# EAGLE design lab5_sriley (EAGLE 9.6.2)
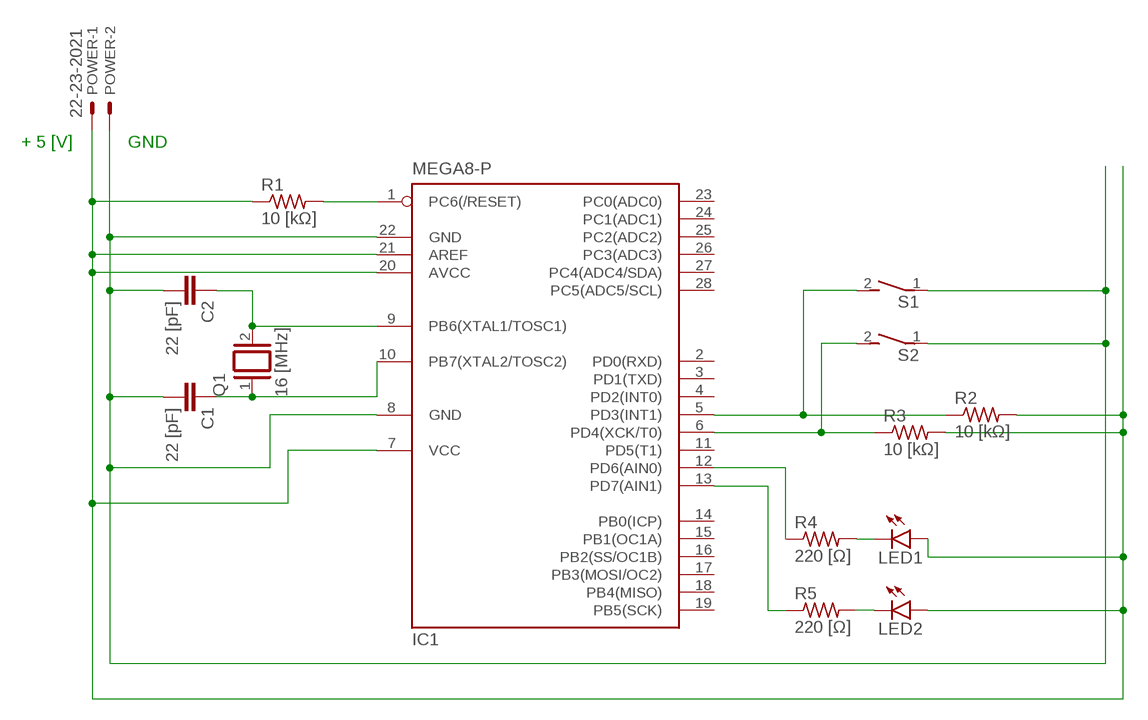
[diagram p0: schematic, sheet 1]

## Parts
C1  22 [pF]  C2,5-3  [C2.5-3]
C2  22 [pF]  C2,5-3  [C2.5-3]
IC1  MEGA8-P  [DIL28-3]
LED1  LED5MM  [LED5MM]
LED2  LED5MM  [LED5MM]
POWER  22-23-2021  [22-23-2021]
Q1  16 [MHz]  XTAL  [Q]
R1  10 [kΩ]  R-US_0204/7  [0204/7]
R2  10 [kΩ]  R-US_0204/7  [0204/7]
R3  10 [kΩ]  R-US_0204/7  [0204/7]
R4  220 [Ω]  R-US_0204/7  [0204/7]
R5  220 [Ω]  R-US_0204/7  [0204/7]
S1  DS01E  [DS-01]
S2  DS01E  [DS-01]

## Nets
N$1: C2.1 IC1.9(PB6(XTAL1/TOSC1)) Q1.2
N$2: C1.1 IC1.10(PB7(XTAL2/TOSC2)) Q1.1
N$3: C1.2 C2.2 IC1.8(GND) IC1.22(GND) POWER.2 S1.1 S2.1
N$4: IC1.7(VCC) IC1.20(AVCC) IC1.21(AREF) LED1.A LED2.A POWER.1 R1.1 R2.2 R3.2
N$5: IC1.1(PC6(/RESET)) R1.2
N$6: IC1.5(PD3(INT1)) R2.1 S1.2
N$7: IC1.6(PD4(XCK/T0)) R3.1 S2.2
N$8: LED1.K(C) R4.2
N$9: LED2.K(C) R5.2
N$10: IC1.12(PD6(AIN0)) R4.1
N$11: IC1.13(PD7(AIN1)) R5.1
Unconnected: IC1.2(PD0(RXD)) IC1.3(PD1(TXD)) IC1.4(PD2(INT0)) IC1.11(PD5(T1)) IC1.14(PB0(ICP)) IC1.15(PB1(OC1A)) IC1.16(PB2(SS/OC1B)) IC1.17(PB3(MOSI/OC2)) IC1.18(PB4(MISO)) IC1.19(PB5(SCK)) IC1.23(PC0(ADC0)) IC1.24(PC1(ADC1)) IC1.25(PC2(ADC2)) IC1.26(PC3(ADC3)) IC1.27(PC4(ADC4/SDA)) IC1.28(PC5(ADC5/SCL))

## Notes on the sheet
- + 5 [V] | GND

## Library data of the parts
C1 C2 = capacitor-wima:C: CAPACITOR naming: grid - package width
IC1 = atmel:MEGA8-P: MICROCONTROLLER 8 Kbytes FLASH, 1 kbytes SRAM, 512 bytes EEPROM, USART, 4-channel 10 bit ADC, 2-channel 8 bit ADC Pin compatible with Atmega48, ATMega88, ATMega168 Source: avr.lbr; OC_FARNELL: unknown; OC_NEWARK: unknown
LED1 LED2 = led:LED: LED OSRAM: - CHIPLED LG R971, LG N971, LY N971, LG Q971, LY Q971, LO R971, LY R971 LH N974, LH R974 LS Q976, LO Q976, LY Q976 LO Q996 - Hyper CHIPLED LW Q18S LB Q993, LB Q99A, LB R99A - SideLED LS A670, LO A670, LY A670, LG A670, LP A670 LB A673, LV A673, LT A673, LW A673 LH A674 LY A675 LS A676, LA A676, LO A676, LY A676, LW A676 LS A679, LY A679, LG A679 - Hyper Micro SIDELED® LS Y876, LA Y876, LO Y876, LY Y876 LT Y87S - SmartLED LW L88C, LW L88S LB L89C, LB L89S, LG L890 LS L89K, LO L89K, LY L89K LS L896, LA L896, LO L896, LY L896 - TOPLED LS T670, LO T670, LY T670, LG T670, LP T670 LSG T670, LSP T670, LSY T670, LOP T670, LYG T670 LG T671, LOG T671, LSG T671 LB T673, LV T673, LT T673, LW T673 LH T674 LS T676, LA T676, LO T676, LY T676, LB T676, LH T676, LSB T676, LW T676 LB T67C, LV T67C, LT T67C, LS T67K, LO T67K, LY T67K, LW E67C LS E67B, LA E67B, LO E67B, LY E67B, LB E67C, LV E67C, LT E67C LW T67C LS T679, LY T679, LG T679 LS T770, LO T770, LY T770, LG T770, LP T770 LB T773, LV T773, LT T773, LW T773 LH T774 LS E675, LA E675, LY E675, LS T675 LS T776, LA T776, LO T776, LY T776, LB T776 LHGB T686 LT T68C, LB T68C - Hyper Mini TOPLED® LB M676 - Mini TOPLED Santana® LG M470 LS M47K, LO M47K, LY M47K Source: http://www.osram.convergy.de LUXEON: - LUMILED® LXK2-PW12-R00, LXK2-PW12-S00, LXK2-PW14-U00, LXK2-PW14-V00 LXK2-PM12-R00, LXK2-PM12-S00, LXK2-PM14-U00 LXK2-PE12-Q00, LXK2-PE12-R00, LXK2-PE12-S00, LXK2-PE14-T00, LXK2-PE14-U00 LXK2-PB12-K00, LXK2-PB12-L00, LXK2-PB12-M00, LXK2-PB14-N00, LXK2-PB14-P00, LXK2-PB14-Q00 LXK2-PR12-L00, LXK2-PR12-M00, LXK2-PR14-Q00, LXK2-PR14-R00 LXK2-PD12-Q00, LXK2-PD12-R00, LXK2-PD12-S00 LXK2-PH12-R00, LXK2-PH12-S00 LXK2-PL12-P00, LXK2-PL12-Q00, LXK2-PL12-R00 Source: www.luxeon.com KINGBRIGHT: KA-3528ASYC Source: www.kingbright.com
POWER = con-molex:22-23-2021: .100" (2.54mm) Center Header - 2 Pin; MF: MOLEX; MPN: 22-23-2021; OC_FARNELL: 1462926; OC_NEWARK: 25C3832
Q1 = special:XTAL: CRYSTAL
R1-R5 = rcl:R-US_: RESISTOR, American symbol; SPICEPREFIX: R
S1 S2 = switch-dil:DS01E: DIL/CODE SWITCH; OC_FARNELL: unknown; OC_NEWARK: unknown

## Net classes
0 default: width 0.813 mm

## Board
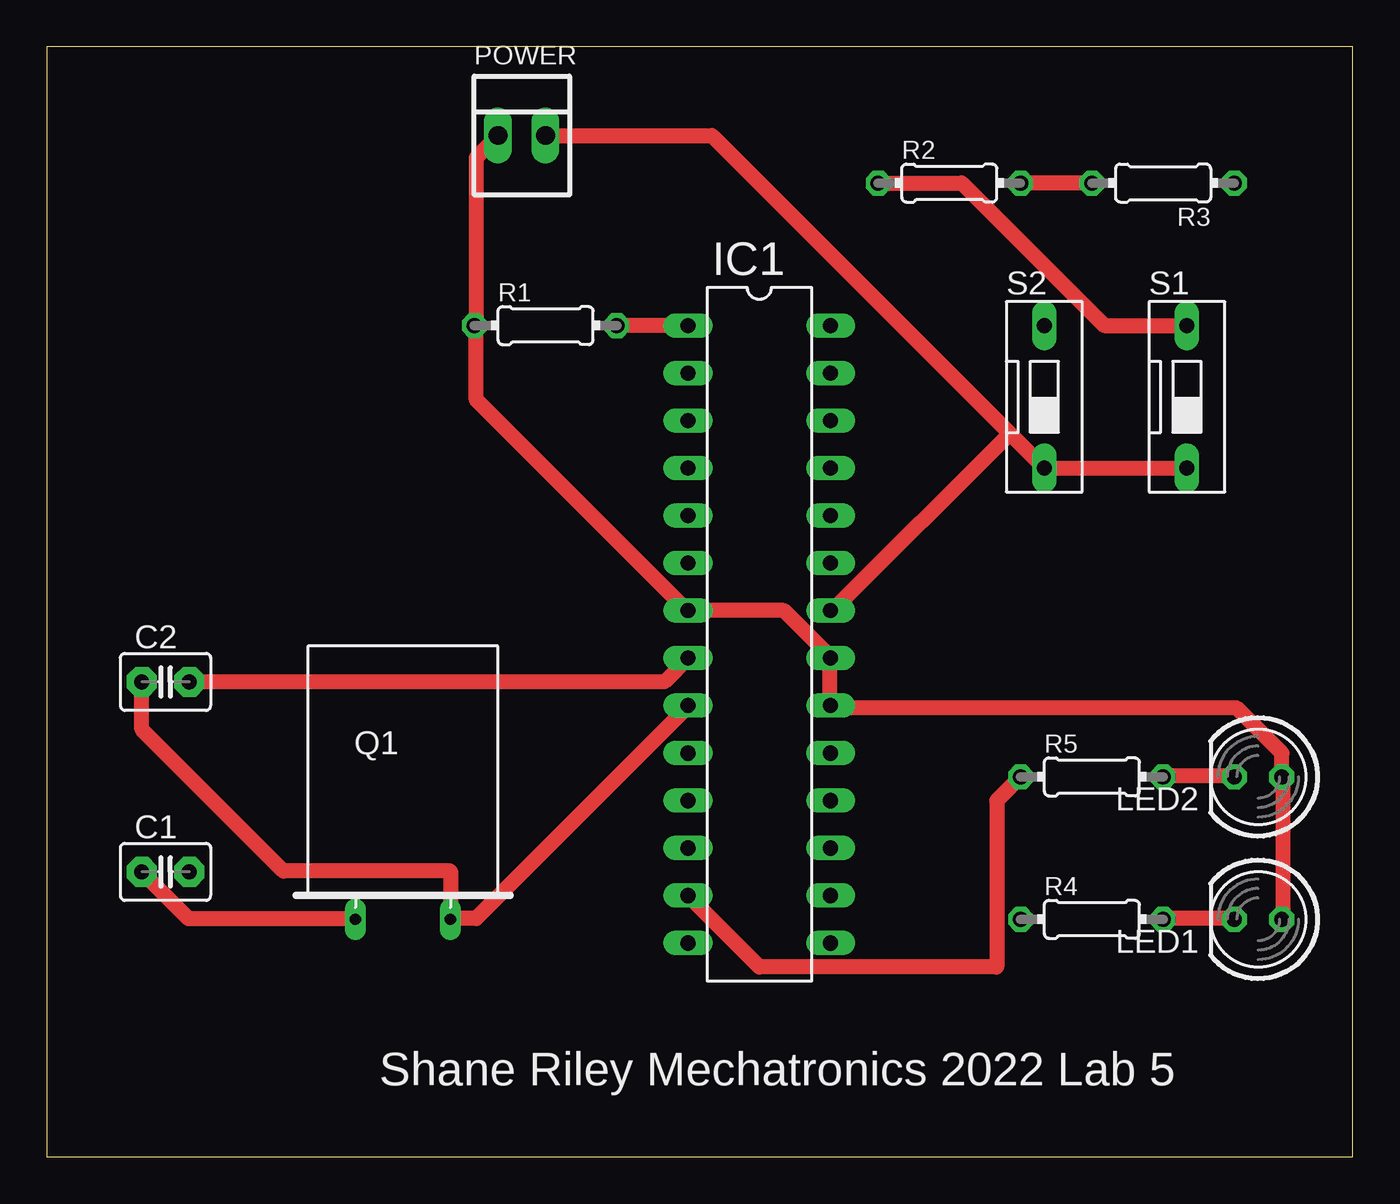
[diagram p1: board, top side]
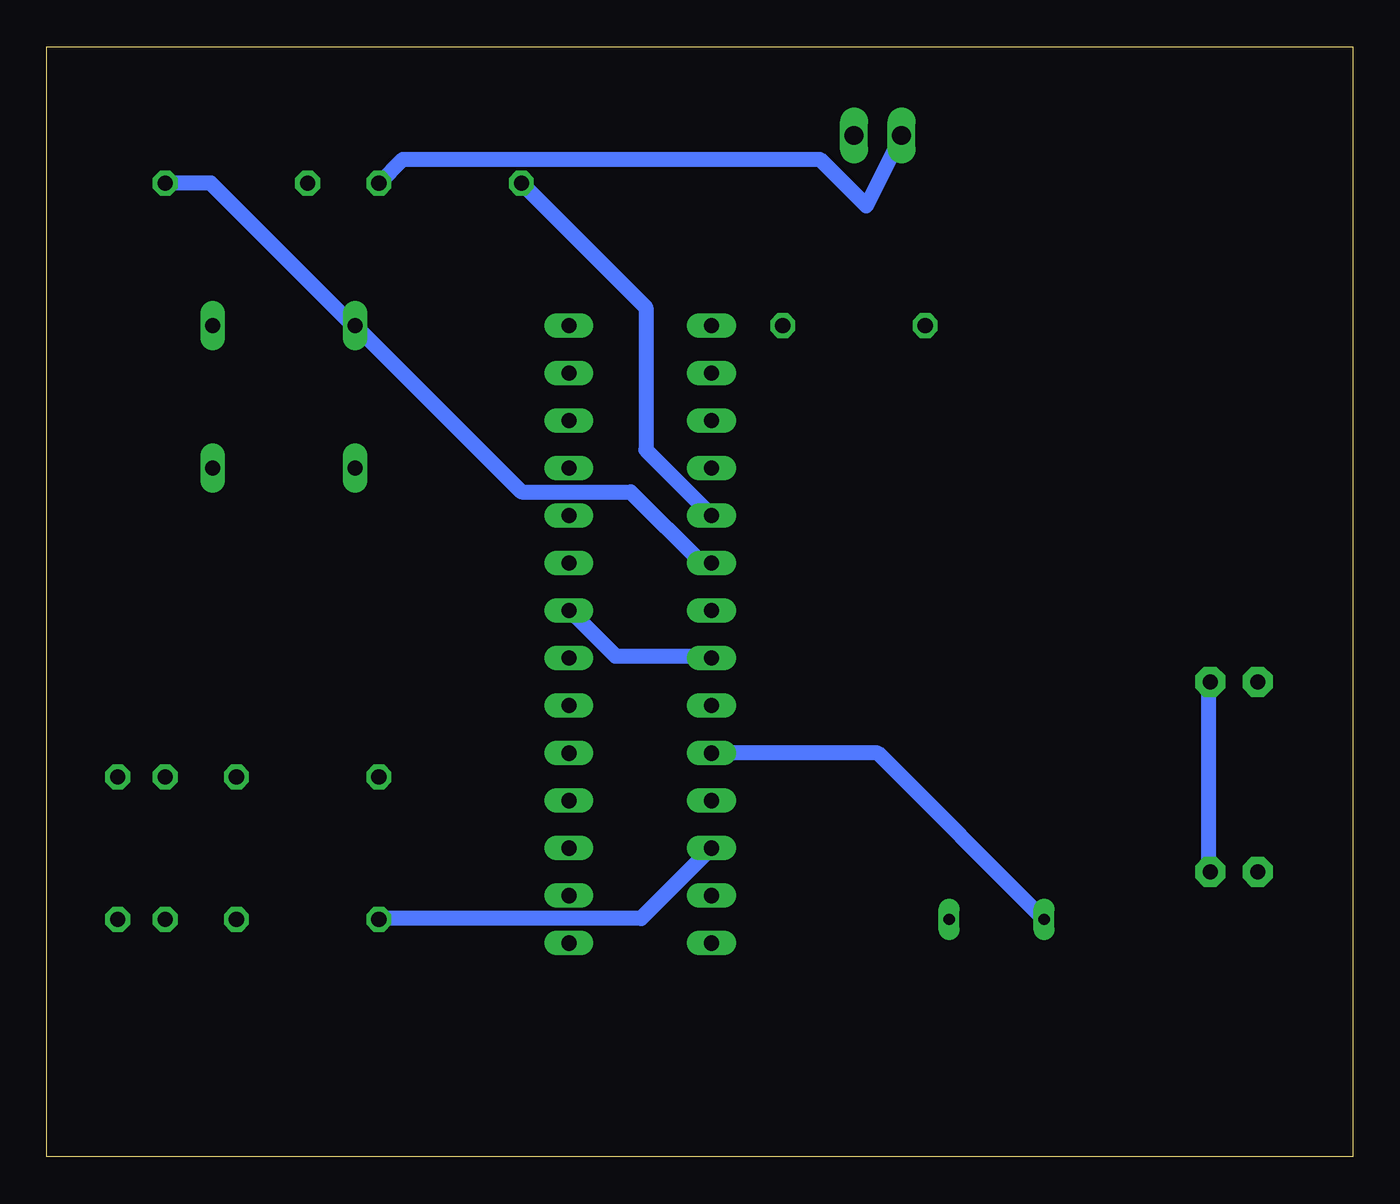
[diagram p2: board, bottom side, seen from below]

Size 69.83 x 59.36 mm. Coordinates in mm from the lower left corner, seen from the top.
Outline: 0,0 69.83,0 69.83,59.36 0,59.36 0,0
Copper layers (1*16): Top 0.035mm / dielectric 1.5mm / Bottom 0.035mm
Design rules "default *": minimum track width 6mil, minimum drill 0.35mm, track to track 6mil, track to pad 6mil, pad to pad 6mil, via to via 6mil, smd to smd 6mil, copper to edge 40mil, drill to drill 6mil, minimum pad ring 10mil, minimum via ring 8mil, stop-mask expansion 4mil, vias tented up to drill 0mil, thermal gap 10mil

### Footprints (pad centres in the part's own frame; a part is rotated, then mirrored left to right if it is on the bottom)
C2.5-3 = drill 0.813 pad 1.6 octagon: 1 -1.27,0; 2 1.27,0
DIL28-3 = drill 0.813 long: 1 -16.51,-3.81; 2 -13.97,-3.81; 3 -11.43,-3.81; 4 -8.89,-3.81; 5 -6.35,-3.81; 6 -3.81,-3.81; 7 -1.27,-3.81; 8 1.27,-3.81; 9 3.81,-3.81; 10 6.35,-3.81; 11 8.89,-3.81; 12 11.43,-3.81; 13 13.97,-3.81; 14 16.51,-3.81; 15 16.51,3.81; 16 13.97,3.81; 17 11.43,3.81; 18 8.89,3.81; 19 6.35,3.81; 20 3.81,3.81; 21 1.27,3.81; 22 -1.27,3.81; 23 -3.81,3.81; 24 -6.35,3.81; 25 -8.89,3.81; 26 -11.43,3.81; 27 -13.97,3.81; 28 -16.51,3.81
LED5MM = drill 0.813 octagon: A -1.27,0; K 1.27,0
22-23-2021 = drill 1 long: 1 -1.27,0; 2 1.27,0
Q = drill 0.61 long: 1 -2.54,-7.62; 2 2.54,-7.62
0204/7 = drill 0.813 octagon: 1 -3.81,0; 2 3.81,0
DS-01 = drill 0.813 long: 1 0,-3.81; 2 0,3.81

### Placement (x,y rotation side)
C1  6.35,15.24 0 top
C2  6.35,25.4 0 top
IC1  38.1,27.94 270 top
LED1  64.77,12.7 180 top
LED2  64.77,20.32 180 top
POWER  25.4,54.61 0 top
Q1  19.05,20.32 0 top
R1  26.67,44.45 0 top
R2  48.26,52.07 0 top
R3  59.69,52.07 180 top
R4  55.88,12.7 0 top
R5  55.88,20.32 0 top
S1  60.96,40.64 0 top
S2  53.34,40.64 0 top

### Tracks (layer width: path | path; a pad name or v marks a point on that pad's centre or on a via)
N$1
  Top 0.813: 21.59,12.75 22.96,12.75 34.24,24.03 IC1.9 | C2.1 5.08,22.86 12.65,15.29 21.59,15.29 21.59,12.75 | 21.59,12.75 Q1.2
N$2
  Top 0.813: C1.1 7.57,12.75 16.41,12.75 Q1.1
  Bottom 0.813: IC1.10 25.4,21.59 Q1.1
N$3
  Top 0.813: POWER.2 35.56,54.61 51.49,38.68 | 51.49,38.68 S2.1 S1.1 | 51.49,38.68 42.01,29.21 IC1.22 | C2.2 33.02,25.4 IC1.8
  Bottom 0.813: C1.2 7.72,15.34 7.72,25.4 C2.2 | IC1.8 34.39,26.77 39.42,26.77 41.86,29.21 IC1.22
N$4
  Top 0.813: R3.2 R2.2 | 22.96,44.45 22.96,53.44 POWER.1 | LED1.A 66.09,12.75 66.09,20.22 LED2.A 66.04,21.59 63.6,24.03 42.01,24.03 IC1.20 41.86,24.18 41.86,26.62 IC1.21 41.86,26.77 39.42,29.21 IC1.7 34.24,29.21 22.96,40.49 22.96,44.45 | 22.96,44.45 R1.1
  Bottom 0.813: R2.2 50.8,53.34 28.5,53.34 26.01,50.85 POWER.1
N$5
  Top 0.813: IC1.1 R1.2
N$6
  Top 0.813: S1.2 56.54,44.45 48.92,52.07 R2.1
  Bottom 0.813: IC1.5 37.8,37.8 37.8,45.41 R2.1
N$7
  Bottom 0.813: IC1.6 34.8,31.75 38.61,35.56 44.45,35.56 S2.2 53.44,44.45 61.06,52.07 R3.1
N$8
  Top 0.813: R4.2 59.69,12.75 63.5,12.75 LED1.K
N$9
  Top 0.813: R5.2 59.69,20.37 63.5,20.37 LED2.K
N$10
  Bottom 0.813: IC1.12 38.05,12.75 52.07,12.75 R4.1
N$11
  Top 0.813: IC1.13 38.1,10.16 50.8,10.16 50.8,19.05 R5.1

### Text on the board
tsilk: Shane Riley Mechatronics 2022 Lab 5